# Altium schematic sheet MCU.SchDoc
size A4; SheetNumber: 8; SheetTotal: 10
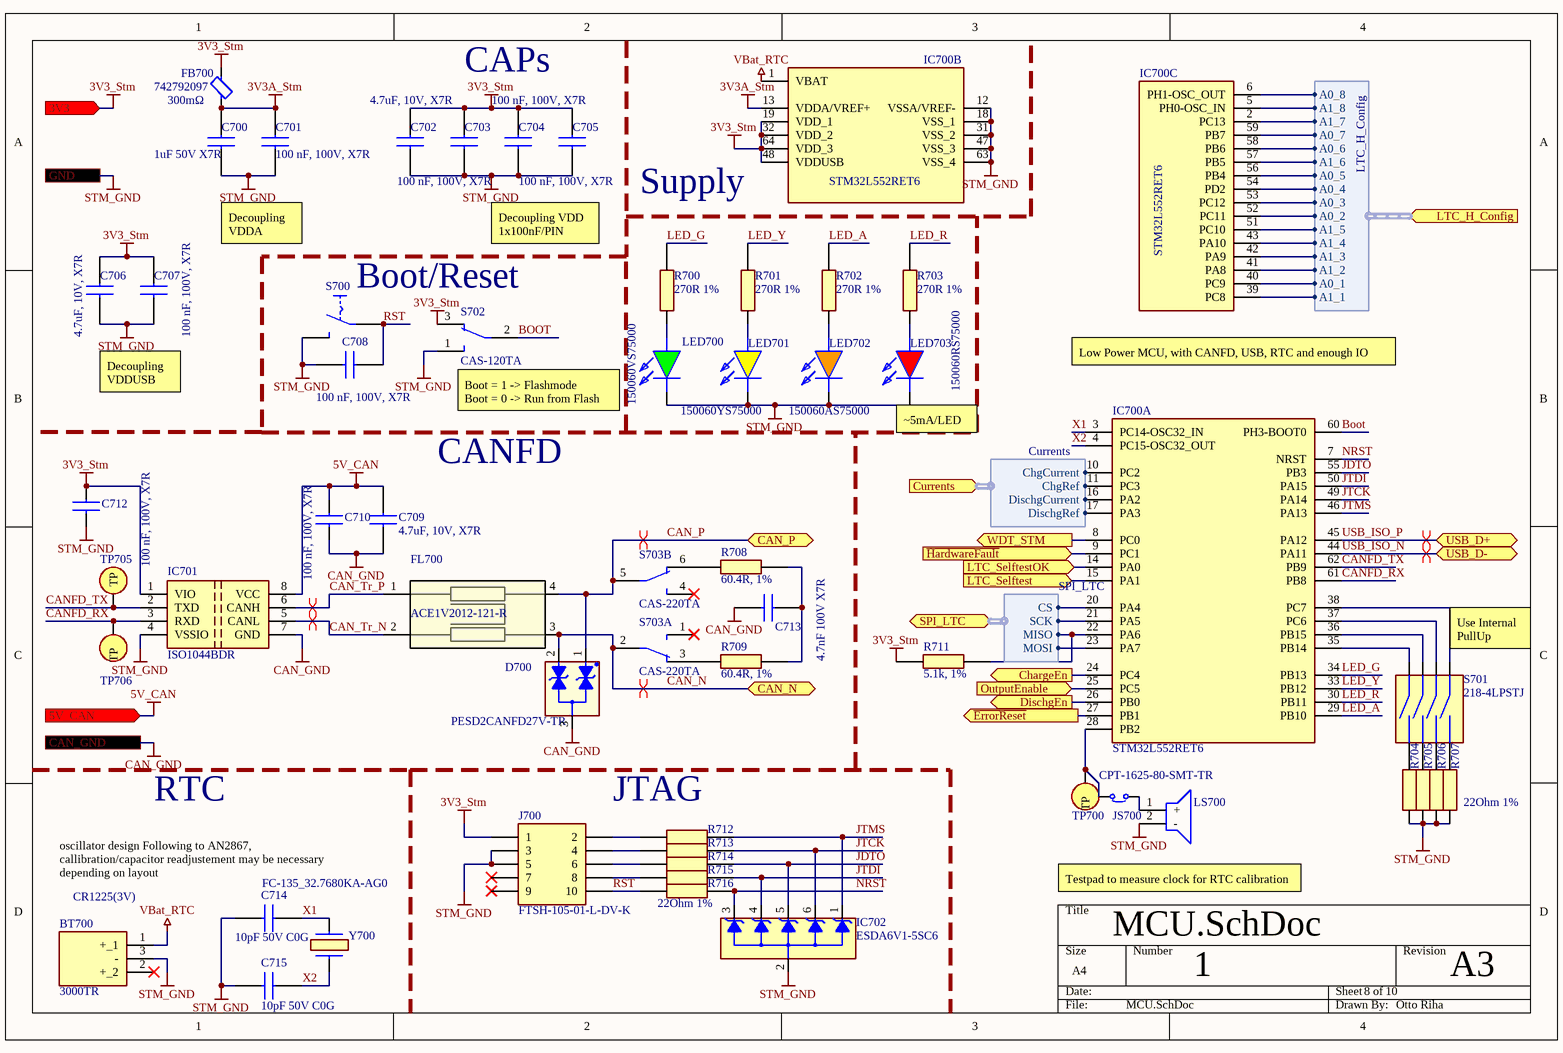
[diagram p0: MCU.SchDoc]

## Parts
(Parts that share a designator on the sheet are numbered #1, #2 ... from top to bottom, then left to right.)
BT700  3000TR  [3000TR]
C700  1uF 50V X7R  [CAPC1608X90N]
C701  100 nF, 100V, X7R  [MAJx16]
C702  4.7uF, 10V, X7R  [GRM18x]
C703  100 nF, 100V, X7R  [MAJx16]
C704  100 nF, 100V, X7R  [MAJx16]
C705  100 nF, 100V, X7R  [MAJx16]
C706  4.7uF, 10V, X7R  [GRM18x]
C707  100 nF, 100V, X7R  [MAJx16]
C708  100 nF, 100V, X7R  [MAJx16]
C709  4.7uF, 10V, X7R  [GRM18x]
C710  100 nF, 100V, X7R  [MAJx16]
C712  100 nF, 100V, X7R  [MAJx16]
C713  4.7nF 100V X7R  [CAPC1608X80N]
C714  10pF 50V C0G  [CAPC1608X90N]
C715  10pF 50V C0G  [CAPC1608X90N]
D700  PESD2CANFD27V-TR  [SOT95P230X110-3N]
FB700  742792097  DC Resistance (DCR): 300mΩ  [FP-742792097-MFG]
FL700  ACE1V2012-121-R  [ACE1V2012121R]
IC700#1  STM32L552RET6  [QFP50P1200X1200X160-64N]  (part B of 2)
IC700#2  STM32L552RET6  [QFP50P1200X1200X160-64N]  (parts A,C of 3)
IC701  ISO1044BDR  [SOIC127P600X175-8N]
IC702  ESDA6V1-5SC6  [SOT95P280X145-6N]
J700  FTSH-105-01-L-DV-K  [FTSH10501LDVK]
JS700  SolderJumper  [SolderJumper]  (value not drawn)
LED700  150060VS75000  [LEDC1608X80N]
LED701  150060YS75000  [LEDC1608X80N]
LED702  150060AS75000  [LEDC1608X80N]
LED703  150060RS75000  [LEDC1608X80N]
LS700  CPT-1625-80-SMT-TR  [CPT162580SMTTR]
R700  270R 1%  [RESC1608X55N]
R701  270R 1%  [RESC1608X55N]
R702  270R 1%  [RESC1608X55N]
R703  270R 1%  [RESC1608X55N]
R704  22Ohm 1%  [RESC1608X55N]  (value not drawn)
R705  22Ohm 1%  [RESC1608X55N]  (value not drawn)
R706  22Ohm 1%  [RESC1608X55N]  (value not drawn)
R707  22Ohm 1%  [RESC1608X55N]
R708  60.4R, 1%  [RESC1608X55N]
R709  60.4R, 1%  [RESC1608X55N]
R711  5.1k, 1%  [RESC1608X55N]
R712  value 22Ohm  [RESC1608X55N]  (hidden comment: 22Ohm 1%)
R713  value 22Ohm  [RESC1608X55N]  (hidden comment: 22Ohm 1%)
R714  value 22Ohm  [RESC1608X55N]  (hidden comment: 22Ohm 1%)
R715  value 22Ohm  [RESC1608X55N]  (hidden comment: 22Ohm 1%)
R716  22Ohm 1%  [RESC1608X55N]
S700  MJTP1140A  [MJTP1140A]  (value not drawn)
S701  218-4LPSTJ  [2184LPSTJ]
S702  CAS-120TA  [CAS120TA]
S703  CAS-220TA  [CAS220TA]  (parts A,B of 2)
TP700  Testpoint  [Testpoint]  (value not drawn)
TP705  Testpoint  [Testpoint]  (value not drawn)
TP706  Testpoint  [Testpoint]  (value not drawn)
Y700  FC-135_32.7680KA-AG0  [FC135327680KAAG0]

## Ports
3V3 (in, see Main[5C], AuxSupply_USB[2D], PowerPath[1B], Singlepath[1B]), 5V_CAN (in, see Main[5C], AuxSupply_USB[4D]), CAN_GND (see Main[5D], AuxSupply_USB[4D]), CAN_N (bidir, see Main[5C]), CAN_P (bidir, see Main[5C]), ChargeEn (out, see Main[6C]), Currents (in, harness Currents, see Main[6C], PowerPath[3B]), DischgEn (out, see Main[6C]), GND (see Main[5D], AuxSupply_USB[1C], LTC_Hardware[1D], PowerPath[1B], Singlepath[1C]), LTC_H_Config (in, harness LTC_H_Config, see Main[5C]), LTC_Selftest (in, see Main[5C]), LTC_SelftestOK (in, see Main[5C]), OutputEnable (in, see Main[6C], PowerPath[2D], Singlepath[2C]), SPI_LTC (bidir, harness SPI_LTC, see Main[5C], LTC_Soft[3A]), USB_D+ (bidir, see Main[5C], AuxSupply_USB[3A]), USB_D- (bidir, see Main[5C], AuxSupply_USB[3A]), WDT_STM (out, see Main[5C]), ~{ErrorReset} (out, see Main[6C], PowerPath[1D]), ~{HardwareFault} (in, see Main[5C])

## Harnesses
SPI_LTC: MISO, MOSI, SCK, CS
LTC_H_Config: A0_1, A0_2, A0_3, A0_4, A0_5, A0_6, A0_7, A0_8, A1_1, A1_2, A1_3, A1_4, A1_5, A1_6, A1_7, A1_8
Currents: DischgCurrent, DischgRef, ChgRef, ChgCurrent

## Nets
3V3_Stm: C702.2 C703.2 C704.2 C705.2 C706.2 C707.2 C712.2 FB700.2 IC700#1.19(VDD_1) IC700#1.32(VDD_2) IC700#1.48(VDDUSB) IC700#1.64(VDD_3) IC701.1(VIO) J700.1 R711.1 S702.3(NC_1) ; port 3V3
3V3A_Stm: C700.2 C701.2 FB700.1 IC700#1.13(VDDA/VREF+)
5V_CAN: C709.2 C710.2 IC701.8(VCC) ; port 5V_CAN
CAN_GND: C709.1 C710.1 C713.1 D700.3(A) IC701.7(GND) ; port CAN_GND
STM_GND: BT700.3(-) C700.1 C701.1 C702.1 C703.1 C704.1 C705.1 C706.1 C707.1 C708.2 C712.1 C714.2 C715.2 IC700#1.12(VSSA/VREF-) IC700#1.18(VSS_1) IC700#1.31(VSS_2) IC700#1.47(VSS_3) IC700#1.63(VSS_4) IC701.4(VSSIO) IC702.2(K2) J700.3 J700.5 LED700.1(K) LED701.1(K) LED702.1(K) LED703.1(K) LS700.2(-) R704.1 R705.1 R706.1 R707.1 S700.2 S702.1(NO_1) ; port GND
VBat_RTC: BT700.1(+_1) IC700#1.1(VBAT)
BOOT: IC700#2.60(PH3-BOOT0) S702.2(COM_1)
CAN_N: D700.2(K2) FL700.3 S703.2(COM_1) ; port CAN_N
CAN_P: D700.1(K1) FL700.4 S703.5(COM_2) ; port CAN_P
CAN_Tr_N: FL700.2 IC701.5(CANL)
CAN_Tr_P: FL700.1 IC701.6(CANH)
CANFD_RX: IC700#2.61(PB8) IC701.3(RXD) TP706.1(TP)
CANFD_TX: IC700#2.62(PB9) IC701.2(TXD) TP705.1(TP)
ChargeEn: IC700#2.24(PC4) ; port ChargeEn
DischgEn: IC700#2.26(PB0) ; port DischgEn
~{ErrorReset}: IC700#2.27(PB1) ; port ~{ErrorReset}
~{HardwareFault}: IC700#2.9(PC1) ; port ~{HardwareFault}
JDTO: IC700#2.55(PB3) IC702.5(K3) R714.2
JTCK: IC700#2.49(PA14) IC702.6(K2) R713.2
JTDI: IC700#2.50(PA15) IC702.4(K4) R715.2
JTMS: IC700#2.46(PA13) IC702.1(K1) R712.2
LED_A: IC700#2.29(PB10) R702.2
LED_G: IC700#2.34(PB13) R700.2
LED_R: IC700#2.30(PB11) R703.2
LED_Y: IC700#2.33(PB12) R701.2
LTC_Selftest: IC700#2.15(PA1) ; port LTC_Selftest
LTC_SelftestOK: IC700#2.14(PA0) ; port LTC_SelftestOK
NRST: IC700#2.7(NRST) IC702.3(K5) R716.2
OutputEnable: IC700#2.25(PC5) ; port OutputEnable
RST: C708.1 J700.10 R716.1 S700.1
USB_ISO_N: IC700#2.44(PA11) ; port USB_D-
USB_ISO_P: IC700#2.45(PA12) ; port USB_D+
WDT_STM: IC700#2.8(PC0) ; port WDT_STM
X1: C714.1 IC700#2.3(PC14-OSC32_IN) Y700.1(CRYSTAL_1)
X2: C715.1 IC700#2.4(PC15-OSC32_OUT) Y700.2(CRYSTAL_2)
NetC713_2: C713.2 R708.2 R709.1
NetIC700#2_2: IC700#2.2(PC13) ; port LTC_H_Config.A1_7
NetIC700#2_5: IC700#2.5(PH0-OSC_IN) ; port LTC_H_Config.A1_8
NetIC700#2_6: IC700#2.6(PH1-OSC_OUT) ; port LTC_H_Config.A0_8
NetIC700#2_10: IC700#2.10(PC2) ; port Currents.ChgCurrent
NetIC700#2_11: IC700#2.11(PC3) ; port Currents.ChgRef
NetIC700#2_16: IC700#2.16(PA2) ; port Currents.DischgCurrent
NetIC700#2_17: IC700#2.17(PA3) ; port Currents.DischgRef
NetIC700#2_20: IC700#2.20(PA4) ; port SPI_LTC.CS
NetIC700#2_21: IC700#2.21(PA5) ; port SPI_LTC.SCK
NetIC700#2_22: IC700#2.22(PA6) R711.2 ; port SPI_LTC.MISO
NetIC700#2_23: IC700#2.23(PA7) ; port SPI_LTC.MOSI
NetIC700#2_28: IC700#2.28(PB2) JS700.1 TP700.1(TP)
NetIC700#2_35: IC700#2.35(PB14) S701.B1
NetIC700#2_36: IC700#2.36(PB15) S701.B2
NetIC700#2_37: IC700#2.37(PC6) S701.B3
NetIC700#2_38: IC700#2.38(PC7) S701.B4
NetIC700#2_39: IC700#2.39(PC8) ; port LTC_H_Config.A1_1
NetIC700#2_40: IC700#2.40(PC9) ; port LTC_H_Config.A0_1
NetIC700#2_41: IC700#2.41(PA8) ; port LTC_H_Config.A1_2
NetIC700#2_42: IC700#2.42(PA9) ; port LTC_H_Config.A1_3
NetIC700#2_43: IC700#2.43(PA10) ; port LTC_H_Config.A1_4
NetIC700#2_51: IC700#2.51(PC10) ; port LTC_H_Config.A1_5
NetIC700#2_52: IC700#2.52(PC11) ; port LTC_H_Config.A0_2
NetIC700#2_53: IC700#2.53(PC12) ; port LTC_H_Config.A0_3
NetIC700#2_54: IC700#2.54(PD2) ; port LTC_H_Config.A0_4
NetIC700#2_56: IC700#2.56(PB4) ; port LTC_H_Config.A0_5
NetIC700#2_57: IC700#2.57(PB5) ; port LTC_H_Config.A1_6
NetIC700#2_58: IC700#2.58(PB6) ; port LTC_H_Config.A0_6
NetIC700#2_59: IC700#2.59(PB7) ; port LTC_H_Config.A0_7
NetJ700_2: J700.2 R712.1
NetJ700_4: J700.4 R713.1
NetJ700_6: J700.6 R714.1
NetJ700_8: J700.8 R715.1
NetJS700_2: JS700.2 LS700.1(+)
NetLED700_2: LED700.2(A) R700.1
NetLED701_2: LED701.2(A) R701.1
NetLED702_2: LED702.2(A) R702.1
NetLED703_2: LED703.2(A) R703.1
NetR704_2: R704.2 S701.A1
NetR705_2: R705.2 S701.A2
NetR706_2: R706.2 S701.A3
NetR707_2: R707.2 S701.A4
NetR708_1: R708.1 S703.6(NC_2)
NetR709_2: R709.2 S703.3(NC_1)

Not connected (* = marked no-connect by the designer): BT700 2(+_2)*; J700 7* 9*; S703 1(NO_1)* 4(NO_2)*

## Layout directives
differential pair: CAN_N, CAN_P, CAN_Tr_N, CAN_Tr_P, USB_ISO_N, USB_ISO_P

## Notes on the sheet
- CAPs
- Decoupling VDDA
- Decoupling VDD 1x100nF/PIN
- (near IC700#1) Supply
- Boot/Reset
- Decoupling VDDUSB
- (near IC700#2) Low Power MCU, with CANFD, USB, RTC and enough IO
- (near S702) Boot = 1 -> Flashmode
  Boot = 0 -> Run from Flash
- (near LED703) ~5mA/LED
- CANFD
- (near S701) Use Internal PullUp
- RTC
- JTAG
- oscillator design Following to AN2867, callibration/capacitor readjustement may be necessary depending on layout
- (near BT700) CR1225(3V)
- (near Y700) Type @ to refer to a designator
- (near LS700) Testpad to measure clock for RTC calibration
- 1
- A3
- Otto Riha

## Library data of the parts
BT700 = 3000TR: Battery; Manufacturer_Name: Keystone Electronics; Datasheet Link: https://www.keyelco.com/produchttps://www.mouser.co.za/datasheet/2/215/3000TR-742873.pdft-pdf.cfm?p=777; Height: 3.43mm; Manufacturer_Part_Number: 3000TR; Mouser Part Number: 534-3000TR; Mouser Price/Stock: https://www.mouser.co.uk/ProductDetail/Keystone-Electronics/3000TR?qs=811De8TLL%252BeRUCmGL5ZsKg%3D%3D; Arrow Part Number: 3000TR; Arrow Price/Stock: https://www.arrow.com/en/products/3000tr/keystone-electronics?utm_currency=USD&region=europe
C700 = 06035C105MAT2A: Capacitor 1uF 50V X7R; Manufacturer_Name: Kyocera AVX; Datasheet Link: https://componentsearchengine.com/Datasheets/1/06031A100FAT2A.pdf; Height: 0.9mm; Manufacturer_Part_Number: 06035C105MAT2A; Mouser Part Number: 581-06035C105MAT2A; Mouser Price/Stock: https://www.mouser.co.uk/ProductDetail/KYOCERA-AVX/06035C105MAT2A?qs=%252BdQmOuGyFcHMsevPtc6OZQ%3D%3D; Value: 1uF
C701 C703-C705 C707 C708 C710 C712 = MAJCH168BB7104KTEA01: Capacitor 100nF, 100V, X7R; Manufacturer_Name: TAIYO YUDEN; Datasheet Link: https://ds.yuden.co.jp/TYCOMPAS/or/detail?pn=MAJCH168BB7104KTEA01; Height: 0.8mm; Manufacturer_Part_Number: MAJCH168BB7104KTEA01; Mouser Part Number: 963-MAJCH168BB7104KT; Mouser Price/Stock: https://www.mouser.co.uk/ProductDetail/TAIYO-YUDEN/MAJCH168BB7104KTEA01?qs=ZcfC38r4PovaTBrG0IdezQ%3D%3D; Arrow Part Number: MAJCH168BB7104KTEA01; Arrow Price/Stock: https://www.arrow.com/en/products/majch168bb7104ktea01/taiyo-yuden?utm_currency=USD&region=nac; Supplier 1: Mouser; Supplier Part Number 1: 963-MAJCH168BB7104KT
C702 C706 C709 = GRM188Z71A475KE15J: Capacitor  4.7uF, 10V, X7R; Manufacturer_Name: Murata Electronics; Datasheet Link: https://search.murata.co.jp/Ceramy/image/img/A01X/G101/ENG/GRM188Z71A475KE15-01A.pdf; Height: 0.9mm; Manufacturer_Part_Number: GRM188Z71A475KE15J; Mouser Part Number: 81-GRM188Z71A475KE5J; Mouser Price/Stock: https://www.mouser.co.uk/ProductDetail/Murata-Electronics/GRM188Z71A475KE15J?qs=Ey7%2FXF42M3fe52ZB0l7gLw%3D%3D; Supplier 1: Mouser; Supplier Part Number 1: 81-GRM188Z71A475KE5J
C713 = C1608X7R2A472K080AA: Capacitor 4.7nF 100V X7R; Manufacturer_Name: TDK; Datasheet Link: https://product.tdk.com/info/en/catalog/datasheets/mlcc_commercial_midvoltage_en.pdf; Height: 0.8mm; Manufacturer_Part_Number: C1608X7R2A472K080AA; Mouser Part Number: 810-C1608X7R2A472K; Mouser Price/Stock: https://www.mouser.co.uk/ProductDetail/TDK/C1608X7R2A472K080AA/?qs=NRhsANhppD8eiVaujK4TFA%3D%3D; Arrow Part Number: C1608X7R2A472K080AA; Arrow Price/Stock: https://www.arrow.com/en/products/c1608x7r2a472k080aa/tdk?utm_currency=USD&region=nac; Value: 4.7nF 100V
C714 C715 = 06035A100BAT2A: Capacitor 10pF 50V C0G; Manufacturer_Name: Kyocera AVX; Datasheet Link: https://componentsearchengine.com/Datasheets/1/06031A100FAT2A.pdf; Height: 0.9mm; Manufacturer_Part_Number: 06035A100BAT2A; Mouser Part Number: 581-06035A100BAT2A; Mouser Price/Stock: https://www.mouser.com/Search/Refine.aspx?Keyword=581-06035A100BAT2A
D700 = PESD2CANFD27V-TR: Diode; Manufacturer_Name: Nexperia; Datasheet Link: https://assets.nexperia.com/documents/data-sheet/PESD2CANFD27V-T.pdf; Height: 1.1mm; Manufacturer_Part_Number: PESD2CANFD27V-TR; Mouser Part Number: 771-PESD2CANFD27V-TR; Mouser Price/Stock: https://www.mouser.co.uk/ProductDetail/Nexperia/PESD2CANFD27V-TR?qs=OlC7AqGiEDlVVUGGaoaotA%3D%3D; Arrow Part Number: PESD2CANFD27V-TR; Arrow Price/Stock: null?utm_currency=USD&region=nac
FB700 = CMP-0220-00149-2: FERRITE BEAD 1.5 KOHM 0805 1LN; Max DC Current: 1A; Test Frequency: 100MHz; Impedance: 1.5kR; Inductance: 1.8nH; Tolerance: 25%; Number of Lines: 1; Weight: 0.000388oz; Case Code (Metric): 2012; Material: Ferrite; Width: 1.2mm; Mount: Surface Mount; Packaging: Tape and Reel; Case/Package: SMD/SMT; Case Code (Imperial): 0805; RoHS Compliant: Yes; Series: WE-CBF; Lead Free: Lead Free; Termination: SMD/SMT; Core Material: Ferrite; Depth: 1.2mm; Min Operating Temperature: -55°C; Height: 0.9mm; Current Rating: 1A; Length: 2mm; Max Operating Temperature: 125°C; Max Current Rating: 1A; Package Quantity: 4000
FL700 = ACE1V2012-121-R: Filter; Manufacturer_Name: Eaton; Datasheet Link: https://www.eaton.com/content/dam/eaton/products/electronic-components/resources/data-sheet/eaton-ace1v2012-automotive-common-mode-chip-inductor-data-sheet.pdf; Height: 1.4mm; Manufacturer_Part_Number: ACE1V2012-121-R; Mouser Part Number: 504-ACE1V2012-121-R; Mouser Price/Stock: https://www.mouser.co.uk/ProductDetail/Coiltronics-Eaton/ACE1V2012-121-R?qs=YwPsRIUVAOfYW6FI0EMgkw%3D%3D
IC700#1 IC700#2 = STM32L552RET6: Integrated Circuit; Manufacturer_Name: STMicroelectronics; Datasheet Link: https://www.mouser.in/datasheet/2/389/dm00532748-1799512.pdf; Height: 1.6mm; Manufacturer_Part_Number: STM32L552RET6; Mouser Part Number: 511-STM32L552RET6; Mouser Price/Stock: https://www.mouser.co.uk/ProductDetail/STMicroelectronics/STM32L552RET6?qs=%252B6g0mu59x7I6Ku2G1CuBXA%3D%3D; Arrow Part Number: STM32L552RET6; Arrow Price/Stock: https://www.arrow.com/en/products/stm32l552ret6/stmicroelectronics?region=nac
IC701 = ISO1044BDR: Integrated Circuit; Manufacturer_Name: Texas Instruments; Datasheet Link: http://www.ti.com/lit/gpn/iso1044?HQS=ti-null-null-sf-df-pf-sep-wwe&DCM=yes; Height: 1.75mm; Manufacturer_Part_Number: ISO1044BDR; Mouser Part Number: 595-ISO1044BDR; Mouser Price/Stock: https://www.mouser.co.uk/ProductDetail/Texas-Instruments/ISO1044BDR?qs=DuoOggApuK9UGD9QQWYeTA%3D%3D; Arrow Part Number: ISO1044BDR; Arrow Price/Stock: https://www.arrow.com/en/products/iso1044bdr/texas-instruments?utm_currency=USD&region=nac
IC702 = ESDA6V1-5SC6: Integrated Circuit; Manufacturer_Name: STMicroelectronics; Datasheet Link: http://www.st.com/st-web-ui/static/active/en/resource/technical/document/datasheet/CD00005102.pdf; Height: 1.45mm; Manufacturer_Part_Number: ESDA6V1-5SC6; Mouser Part Number: 511-ESDA6V1-5SC6; Mouser Price/Stock: https://www.mouser.co.uk/ProductDetail/STMicroelectronics/ESDA6V1-5SC6?qs=ZN9SVtODT3yxqNpCUKP6Bg%3D%3D; Arrow Part Number: ESDA6V1-5SC6; Arrow Price/Stock: https://www.arrow.com/en/products/esda6v1-5sc6/stmicroelectronics?region=nac
J700 = FTSH-105-01-L-DV-K: Connector; Manufacturer_Name: SAMTEC; Datasheet Link: https://www.arrow.com/en/products/ftsh-105-01-l-dv-k/samtec; Height: 6.1mm; Manufacturer_Part_Number: FTSH-105-01-L-DV-K; Mouser Part Number: 200-FTSH10501LDVK; Mouser Price/Stock: https://www.mouser.co.uk/ProductDetail/Samtec/FTSH-105-01-L-DV-K?qs=%252B5JSS813miOqo3Vy%252BvhCFg%3D%3D; Arrow Part Number: FTSH-105-01-L-DV-K; Arrow Price/Stock: https://www.arrow.com/en/products/ftsh-105-01-l-dv-k/samtec?utm_currency=USD&region=europe
LED700 = 150060VS75000: LED; Manufacturer_Name: Wurth Elektronik; Datasheet Link: https://componentsearchengine.com/Datasheets/2/150060VS75000.pdf; Height: 0.8mm; Manufacturer_Part_Number: 150060VS75000; Mouser Part Number: 710-150060VS75000; Mouser Price/Stock: https://www.mouser.co.uk/ProductDetail/Wurth-Elektronik/150060VS75000?qs=LlUlMxKIyB1Q1Bi5mQ%2FKLw%3D%3D
LED701 = 150060YS75000: LED; Manufacturer_Name: Wurth Elektronik; Datasheet Link: http://uk.rs-online.com/web/p/products/8154219; Height: 0.8mm; Manufacturer_Part_Number: 150060YS75000; Mouser Part Number: 710-150060YS75000; Mouser Price/Stock: https://www.mouser.co.uk/ProductDetail/Wurth-Elektronik/150060YS75000?qs=LlUlMxKIyB0nKmwefHgtZw%3D%3D
LED702 = 150060AS75000: LED; Manufacturer_Name: Wurth Elektronik; Datasheet Link: https://componentsearchengine.com/Datasheets/2/150060AS75000.pdf; Height: 0.8mm; Manufacturer_Part_Number: 150060AS75000; Mouser Part Number: 710-150060AS75000; Mouser Price/Stock: https://www.mouser.co.uk/ProductDetail/Wurth-Elektronik/150060AS75000?qs=d0WKAl%252BL4KbvMBYryeof0Q%3D%3D
LED703 = 150060RS75000: LED; Manufacturer_Name: Wurth Elektronik; Datasheet Link: http://katalog.we-online.de/led/datasheet/150060RS75000.pdf; Height: 0.8mm; Manufacturer_Part_Number: 150060RS75000; Mouser Part Number: 710-150060RS75000; Mouser Price/Stock: https://www.mouser.co.uk/ProductDetail/Wurth-Elektronik/150060RS75000?qs=LlUlMxKIyB3QnmZ3fw%2FVCA%3D%3D
LS700 = CPT-1625-80-SMT-TR: Loudspeaker or Buzzer; Manufacturer_Name: Same Sky; Datasheet Link: https://www.sameskydevices.com/product/resource/supplyframepdf/cpt-1625-80-smt-tr.pdf; Height: 3mm; Manufacturer_Part_Number: CPT-1625-80-SMT-TR; Mouser Part Number: 490-CPT-1625-80SMTTR; Mouser Price/Stock: https://www.mouser.co.uk/ProductDetail/CUI-Devices/CPT-1625-80-SMT-TR?qs=P1JMDcb91o43eCFIymFs3Q%3D%3D
R700-R703 = ERJ-3EKF2700V: Resistor 270R 1%; Manufacturer_Name: Panasonic; Datasheet Link: http://industrial.panasonic.com/cdbs/www-data/pdf/RDA0000/AOA0000C86.pdf; Height: 0.55mm; Manufacturer_Part_Number: ERJ-3EKF2700V; Mouser Part Number: 667-ERJ-3EKF2700V; Mouser Price/Stock: https://www.mouser.co.uk/ProductDetail/Panasonic/ERJ-3EKF2700V?qs=iBwFsHVUAOdaUVxng5ojCw%3D%3D; Arrow Part Number: ERJ-3EKF2700V; Arrow Price/Stock: https://www.arrow.com/en/products/erj-3ekf2700v/panasonic?region=nac; Value: 270R
R704-R707 R712-R716 = RC0603FR-0722RL: Resistor 22Ohm 1%; Manufacturer_Name: YAGEO; Datasheet Link: http://www.farnell.com/datasheets/1868787.pdf; Height: 0.55mm; Manufacturer_Part_Number: RC0603FR-0722RL; Mouser Part Number: 603-RC0603FR-0722RL; Mouser Price/Stock: https://www.mouser.co.uk/ProductDetail/YAGEO/RC0603FR-0722RL?qs=diQw95jMAeMOsxb8bne7fg%3D%3D; Arrow Part Number: RC0603FR-0722RL; Arrow Price/Stock: https://www.arrow.com/en/products/rc0603fr-0722rl/yageo?region=nac; Supplier 1: Future Electronics; Supplier Part Number 1: 8636706
  R704-R707 R716: Value: 22Ohm
R708 R709 = CPF0603F60R4C1: Resistor 60.4R, 1%; Manufacturer_Name: TE Connectivity; Datasheet Link: https://www.te.com/commerce/DocumentDelivery/DDEController?Action=srchrtrv&DocNm=8-1773459-4_ELEVATOR_ESCALATOR_SOLUTIONS&DocType=Data%20Sheet&DocLang=English&PartCntxt=4-1879335-4&DocFormat=pdf; Height: 0.55mm; Manufacturer_Part_Number: CPF0603F60R4C1; Mouser Part Number: 279-CPF0603F60R4C1; Value: 60.4R; Supplier 1: Mouser; Supplier Part Number 1: 279-CPF0603F60R4C1
R711 = CRCW06035K10FKEBC: Resistor 5.1k, 1%; Manufacturer_Name: Vishay; Datasheet Link: https://www.vishay.com/docs/28773/crcwce3.pdf; Height: 0.55mm; Manufacturer_Part_Number: CRCW06035K10FKEBC; Mouser Part Number: 71-CRCW06035K10FKEBC; Mouser Price/Stock: https://www.mouser.co.uk/ProductDetail/Vishay-Dale/CRCW06035K10FKEBC?qs=wd5RIQLrsJiajonkePuzqw%3D%3D; Arrow Part Number: CRCW06035K10FKEBC; Arrow Price/Stock: https://www.arrow.com/en/products/crcw06035k10fkebc/vishay?region=nac; Value: 5.1k; Supplier 1: Mouser; Supplier Part Number 1: 71-CRCW06035K10FKEBC
S700 = MJTP1140A: Switch; Manufacturer_Name: Apem; Datasheet Link: https://componentsearchengine.com/Datasheets/1/MJTP1140A.pdf; Height: 1.5mm; Manufacturer_Part_Number: MJTP1140A; Mouser Part Number: 642-MJTP1140A; Mouser Price/Stock: https://www.mouser.com/Search/Refine.aspx?Keyword=642-MJTP1140A
S701 = 218-4LPSTJ: Switch; Manufacturer_Name: CTS; Datasheet Link: https://www.ctscorp.com/wp-content/uploads/218.pdf; Height: 2.7mm; Manufacturer_Part_Number: 218-4LPSTJ; Mouser Part Number: 774-218-4LPSTJ; Mouser Price/Stock: https://www.mouser.co.uk/ProductDetail/CTS-Electronic-Components/218-4LPSTJ?qs=qNzHFtQhdJ%2Frpuf7cnHHWA%3D%3D; Arrow Part Number: 218-4LPSTJ; Arrow Price/Stock: https://www.arrow.com/en/products/218-4lpstj/cts
S702 = CAS-120TA: Switch; Manufacturer_Name: Nidec Copal; Datasheet Link: https://www.mouser.com/datasheet/2/972/cas-1628136.pdf; Height: 2.5mm; Manufacturer_Part_Number: CAS-120TA; Mouser Part Number: 229-CAS-120TA; Mouser Price/Stock: https://www.mouser.co.uk/ProductDetail/Nidec-Components/CAS-120TA?qs=XeJtXLiO41SaUq1d6RzxrQ%3D%3D; Arrow Part Number: CAS-120TA; Arrow Price/Stock: https://www.arrow.com/en/products/cas-120ta/nidec-copal-electronics
S703 = CAS-220TA: Switch; Manufacturer_Name: Nidec Copal; Datasheet Link: https://www.digikey.ph/en/products/detail/nidec-components-corporation/CAS-220TA/341663?msockid=39f1ec84d77b6f4428b7f904d6676eed; Height: 2.5mm; Manufacturer_Part_Number: CAS-220TA; Mouser Part Number: 229-CAS-220TA; Mouser Price/Stock: https://www.mouser.co.uk/ProductDetail/Nidec-Components/CAS-220TA?qs=XeJtXLiO41Tq8gHkPWHRfA%3D%3D
Y700 = FC-135_32.7680KA-AG0: Crystal or Oscillator; Manufacturer_Name: Epson Timing; Manufacturer_Part_Number: FC-135 32.7680KA-AG0; Datasheet Link: https://support.epson.biz/td/api/doc_check.php?dl=brief_FC-135&lang=en/.pdf; Height: 0.9mm; Mouser Part Number: 732-FC135-32.76KAAG0; Mouser Price/Stock: https://www.mouser.co.uk/ProductDetail/Epson-Timing/FC-135-32.7680KA-AG0?qs=l3LL3yk8ONZCQSM4diwOUg%3D%3D; Arrow Part Number: FC-135 32.7680KA-AG0; Arrow Price/Stock: https://www.arrow.com/en/products/fc-13532.7680ka-ag0/epson-electronics-america?utm_currency=USD&region=nac